# Altium schematic sheet Power_LDO_15V.SchDoc: +/-15V LDO
size Letter; Engineer: Nathan Petersen; DocumentNumber: 10; Revision: v1.2; SheetNumber: 10; SheetTotal: 29
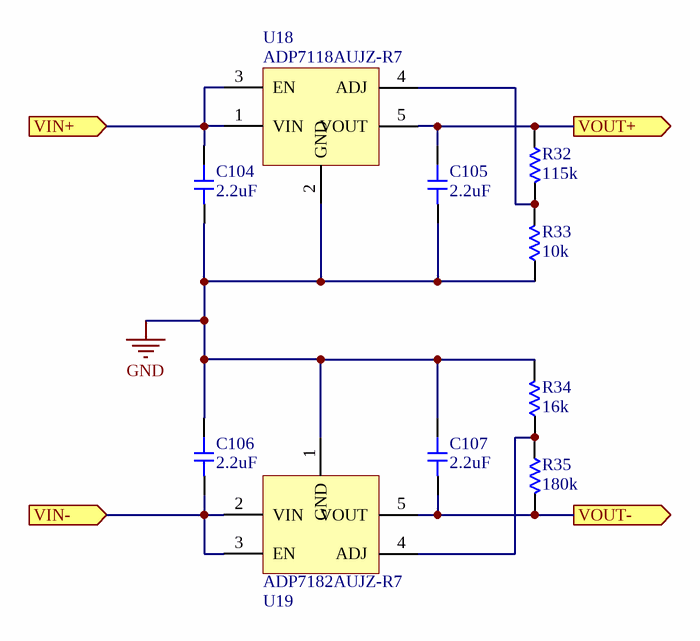
[diagram p0: Power_LDO_15V.SchDoc]

## Parts
C104  value 2.2uF  [0603-CAP]  (hidden comment: Capacitor)
C105  value 2.2uF  [0603-CAP]  (hidden comment: Capacitor)
C106  value 2.2uF  [0603-CAP]  (hidden comment: Capacitor)
C107  value 2.2uF  [0603-CAP]  (hidden comment: Capacitor)
R32  value 115k  [0603-RES]  (hidden comment: Resistor)
R33  value 10k  [0603-RES]  (hidden comment: Resistor)
R34  value 16k  [0603-RES]  (hidden comment: Resistor)
R35  value 180k  [0603-RES]  (hidden comment: Resistor)
U18  ADP7118AUJZ-R7  [TSOT-23]
U19  ADP7182AUJZ-R7  [TSOT-23]

## Ports
VIN+ (in), VIN- (in), VOUT+ (out), VOUT- (out)

## Nets
GND: C104.1 C105.1 C106.2 C107.2 R33.1 R34.2 U18.2(GND) U19.1(GND)
VIN+: C104.2 U18.1(VIN) U18.3(EN) ; port VIN+
VIN-: C106.1 U19.2(VIN) U19.3(EN) ; port VIN-
VOUT+: C105.2 R32.1 U18.5(VOUT) ; port VOUT+
VOUT-: C107.1 R35.2 U19.5(VOUT) ; port VOUT-
NetR32_2: R32.2 R33.2 U18.4(ADJ)
NetR34_1: R34.1 R35.1 U19.4(ADJ)

## Notes on the sheet
- Title:
- File:
- Sheet:
- of
- Revision:
- Time:
- Date:
- Engineer:

## Library data of the parts
U18 = ADP7118AUJZ-R7: IC REG LINEAR 200MA TSOT23-5; Supplier 1: Digi-Key; Supplier Part Number 1: ADP7118AUJZ-R7-ND
U19 = ADP7182AUJZ-R7: IC REG LINEAR 200MA 5TSOT; Supplier 1: Digi-Key; Supplier Part Number 1: ADP7182AUJZ-R7-ND
C104-C107 = Capacitor: Supplier 1: Digi-Key; Supplier Part Number 1: 490-10486-6-ND
R32-R35 = Resistor: Supplier 1: Digi-Key
  R32: Supplier Part Number 1: 311-115KHRDKR-ND
  R33: Supplier Part Number 1: P10.0KHDKR-ND
  R34: Supplier Part Number 1: 311-16.0KHRDKR-ND
  R35: Supplier Part Number 1: 311-180KHRDKR-ND